# Altium schematic sheet Zynq DDR Interface & Termination.SchDoc: Zynq DDR Interface
size A3; DocumentNumber: 5; Revision: A; SheetNumber: 5; SheetTotal: 10
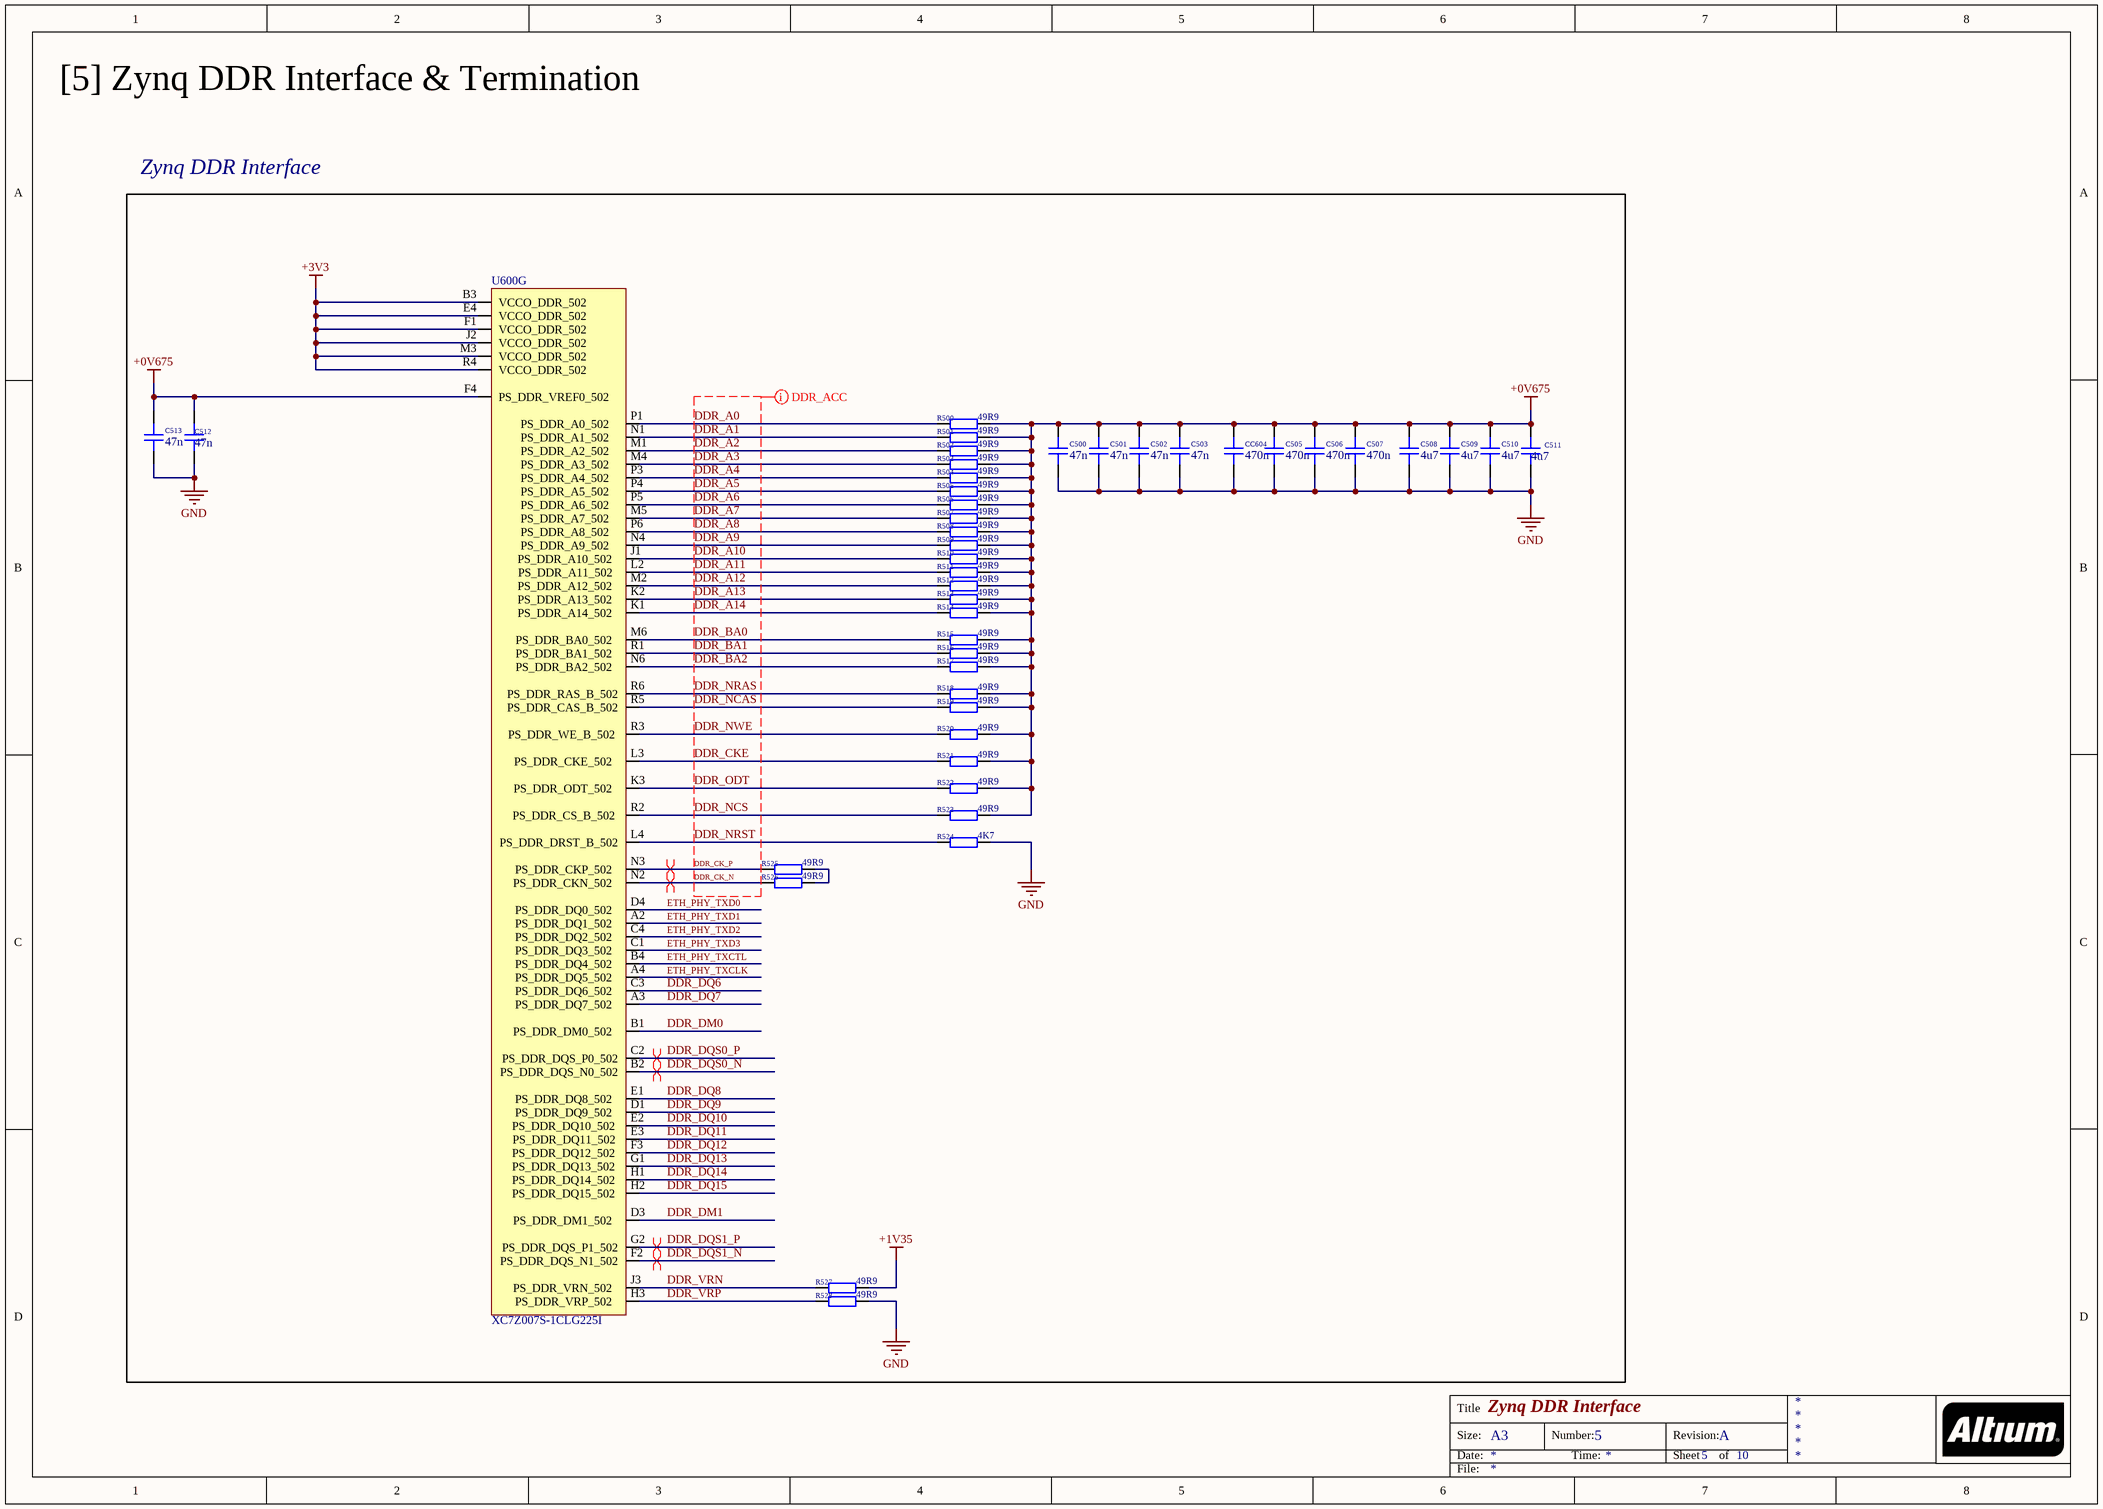
[diagram p0: Zynq DDR Interface & Termination.SchDoc]

## Parts
C500  47n  [CAP_1210]
C501  47n  [CAP_1210]
C502  47n  [CAP_1210]
C503  47n  [CAP_1210]
C505  470n  [CAP_1210]
C506  470n  [CAP_1210]
C507  470n  [CAP_1210]
C508  4u7  [CAP_1210]
C509  4u7  [CAP_1210]
C510  4u7  [CAP_1210]
C511  4u7  [CAP_1210]
C512  47n  [CAP_1210]
C513  47n  [CAP_1210]
CC604  470n  [CAP_1210]
R500  49R9  [RES_0402]
R501  49R9  [RES_0402]
R502  49R9  [RES_0402]
R503  49R9  [RES_0402]
R504  49R9  [RES_0402]
R505  49R9  [RES_0402]
R506  49R9  [RES_0402]
R507  49R9  [RES_0402]
R508  49R9  [RES_0402]
R509  49R9  [RES_0402]
R510  49R9  [RES_0402]
R511  49R9  [RES_0402]
R512  49R9  [RES_0402]
R513  49R9  [RES_0402]
R514  49R9  [RES_0402]
R515  49R9  [RES_0402]
R516  49R9  [RES_0402]
R517  49R9  [RES_0402]
R518  49R9  [RES_0402]
R519  49R9  [RES_0402]
R520  49R9  [RES_0402]
R521  49R9  [RES_0402]
R522  49R9  [RES_0402]
R523  49R9  [RES_0402]
R524  4K7  [RES_0402]
R525  49R9  [RES_0402]
R526  49R9  [RES_0402]
R527  49R9  [RES_0402]
R528  49R9  [RES_0402]
U600  XC7Z007S-1CLG225I  [CLG225]  (part G of 7)

## Blocks framed on the sheet
Zynq DDR Interface: C500-C503 C505-C513 CC604 R500-R528 U600

## Nets
+0V675: C500.2 C501.2 C502.2 C503.2 C505.2 C506.2 C507.2 C508.2 C509.2 C510.2 C511.2 C512.2 C513.2 CC604.2 R500.2 R501.2 R502.2 R503.2 R504.2 R505.2 R506.2 R507.2 R508.2 R509.2 R510.2 R511.2 R512.2 R513.2 R514.2 R515.2 R516.2 R517.2 R518.2 R519.2 R520.2 R521.2 R522.2 R523.2 U600.F4(PS_DDR_VREF0_502)
+1V35: R527.2
+3V3: U600.B3(VCCO_DDR_502) U600.E4(VCCO_DDR_502) U600.F1(VCCO_DDR_502) U600.J2(VCCO_DDR_502) U600.M3(VCCO_DDR_502) U600.R4(VCCO_DDR_502)
GND: C500.1 C501.1 C502.1 C503.1 C505.1 C506.1 C507.1 C508.1 C509.1 C510.1 C511.1 C512.1 C513.1 CC604.1 R524.2 R528.2
DDR_A0: R500.1 U600.P1(PS_DDR_A0_502)
DDR_A1: R501.1 U600.N1(PS_DDR_A1_502)
DDR_A2: R502.1 U600.M1(PS_DDR_A2_502)
DDR_A3: R503.1 U600.M4(PS_DDR_A3_502)
DDR_A4: R504.1 U600.P3(PS_DDR_A4_502)
DDR_A5: R505.1 U600.P4(PS_DDR_A5_502)
DDR_A6: R506.1 U600.P5(PS_DDR_A6_502)
DDR_A7: R507.1 U600.M5(PS_DDR_A7_502)
DDR_A8: R508.1 U600.P6(PS_DDR_A8_502)
DDR_A9: R509.1 U600.N4(PS_DDR_A9_502)
DDR_A10: R510.1 U600.J1(PS_DDR_A10_502)
DDR_A11: R511.1 U600.L2(PS_DDR_A11_502)
DDR_A12: R512.1 U600.M2(PS_DDR_A12_502)
DDR_A13: R513.1 U600.K2(PS_DDR_A13_502)
DDR_A14: R514.1 U600.K1(PS_DDR_A14_502)
DDR_BA0: R515.1 U600.M6(PS_DDR_BA0_502)
DDR_BA1: R516.1 U600.R1(PS_DDR_BA1_502)
DDR_BA2: R517.1 U600.N6(PS_DDR_BA2_502)
DDR_CK_N: R526.1 U600.N2(PS_DDR_CKN_502)
DDR_CK_P: R525.1 U600.N3(PS_DDR_CKP_502)
DDR_CKE: R521.1 U600.L3(PS_DDR_CKE_502)
DDR_DM0: U600.B1(PS_DDR_DM0_502)
DDR_DM1: U600.D3(PS_DDR_DM1_502)
DDR_DQ6: U600.C3(PS_DDR_DQ6_502)
DDR_DQ7: U600.A3(PS_DDR_DQ7_502)
DDR_DQ8: U600.E1(PS_DDR_DQ8_502)
DDR_DQ9: U600.D1(PS_DDR_DQ9_502)
DDR_DQ10: U600.E2(PS_DDR_DQ10_502)
DDR_DQ11: U600.E3(PS_DDR_DQ11_502)
DDR_DQ12: U600.F3(PS_DDR_DQ12_502)
DDR_DQ13: U600.G1(PS_DDR_DQ13_502)
DDR_DQ14: U600.H1(PS_DDR_DQ14_502)
DDR_DQ15: U600.H2(PS_DDR_DQ15_502)
DDR_DQS0_N: U600.B2(PS_DDR_DQS_N0_502)
DDR_DQS0_P: U600.C2(PS_DDR_DQS_P0_502)
DDR_DQS1_N: U600.F2(PS_DDR_DQS_N1_502)
DDR_DQS1_P: U600.G2(PS_DDR_DQS_P1_502)
DDR_NCAS: R519.1 U600.R5(PS_DDR_CAS_B_502)
DDR_NCS: R523.1 U600.R2(PS_DDR_CS_B_502)
DDR_NRAS: R518.1 U600.R6(PS_DDR_RAS_B_502)
DDR_NRST: R524.1 U600.L4(PS_DDR_DRST_B_502)
DDR_NWE: R520.1 U600.R3(PS_DDR_WE_B_502)
DDR_ODT: R522.1 U600.K3(PS_DDR_ODT_502)
DDR_VRN: R527.1 U600.J3(PS_DDR_VRN_502)
DDR_VRP: R528.1 U600.H3(PS_DDR_VRP_502)
ETH_PHY_TXCLK: U600.A4(PS_DDR_DQ5_502)
ETH_PHY_TXCTL: U600.B4(PS_DDR_DQ4_502)
ETH_PHY_TXD0: U600.D4(PS_DDR_DQ0_502)
ETH_PHY_TXD1: U600.A2(PS_DDR_DQ1_502)
ETH_PHY_TXD2: U600.C4(PS_DDR_DQ2_502)
ETH_PHY_TXD3: U600.C1(PS_DDR_DQ3_502)
NetR525_2: R525.2 R526.2

## Layout directives
differential pair: DDR_CK_N, DDR_CK_P, DDR_DQS0_N, DDR_DQS0_P, DDR_DQS1_N, DDR_DQS1_P
mark named DDR_ACC: DDR_A0, DDR_A1, DDR_A2, DDR_A3, DDR_A4, DDR_A5, DDR_A6, DDR_A7, DDR_A8, DDR_A9, DDR_A10, DDR_A11, DDR_A12, DDR_A13, DDR_A14, DDR_BA0, DDR_BA1, DDR_BA2, DDR_CK_N, DDR_CK_P, DDR_CKE, DDR_NCAS, DDR_NCS, DDR_NRAS, DDR_NRST, DDR_NWE, DDR_ODT

## Notes on the sheet
- [5] Zynq DDR Interface & Termination
- Title
- Size:
- Date:
- A3
- Number:
- Time:
- Revision:
- Sheet
- of
- File:

## Library data of the parts
C500-C503 C505-C513 CC604 = CAP_1210: Capacitor SMD 1210; Manufacturer: *; Manufacturer Part Number: *; Distributor Link: *; LCSC: *; Rating: *; Dielectric: *
R500-R528 = RES_0402: Resistor SMD 0402; Manufacturer: *; Manufacturer Part Number: *; Distributor Link: *; LCSC: *
U600 = XC7Z007S-1CLG225I: Xilinx FPGA SoC Zynq 7-Series XC7Z007S CLG255 Package Industrial Temperature Grade; Manufacturer: Xilinx; Manufacturer Part Number: XC7Z007S-1CLG225I